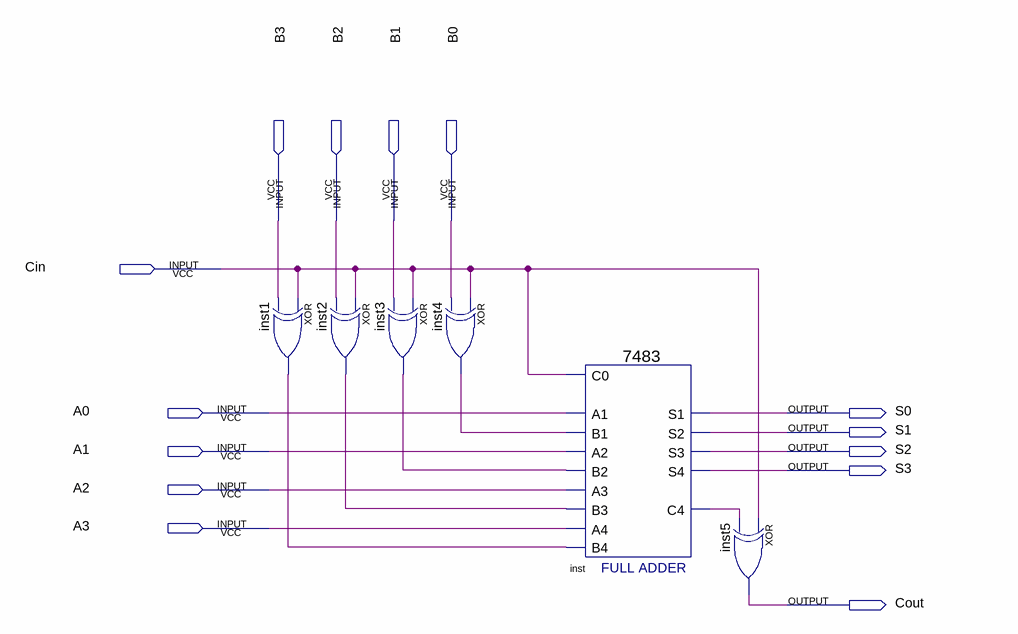
[diagram p0: schematic sheet]
// Quartus schematic Question3.bdf as structural Verilog: 6 symbols, 14 pins
module Question3 (
  input  B3,
  input  B2,
  input  B1,
  input  B0,
  input  Cin,
  input  A0,
  input  A1,
  input  A2,
  input  A3,
  output S0,
  output S1,
  output S2,
  output S3,
  output Cout
);

  wire inst1_out, inst2_out, inst3_out, inst4_out, inst_c4;

  xor inst1 (inst1_out, Cin, B3);
  xor inst2 (inst2_out, Cin, B2);
  xor inst3 (inst3_out, Cin, B1);
  xor inst4 (inst4_out, Cin, B0);
  \7483  inst (
    .B4(inst1_out), .C0(Cin), .A1(A0), .A2(A1), .B1(inst4_out), .B2(inst3_out), .A3(A2), .B3(inst2_out),
    .A4(A3), .S3(S2), .S4(S3), .S2(S1), .C4(inst_c4), .S1(S0));
  xor inst5 (Cout, Cin, inst_c4);
endmodule
